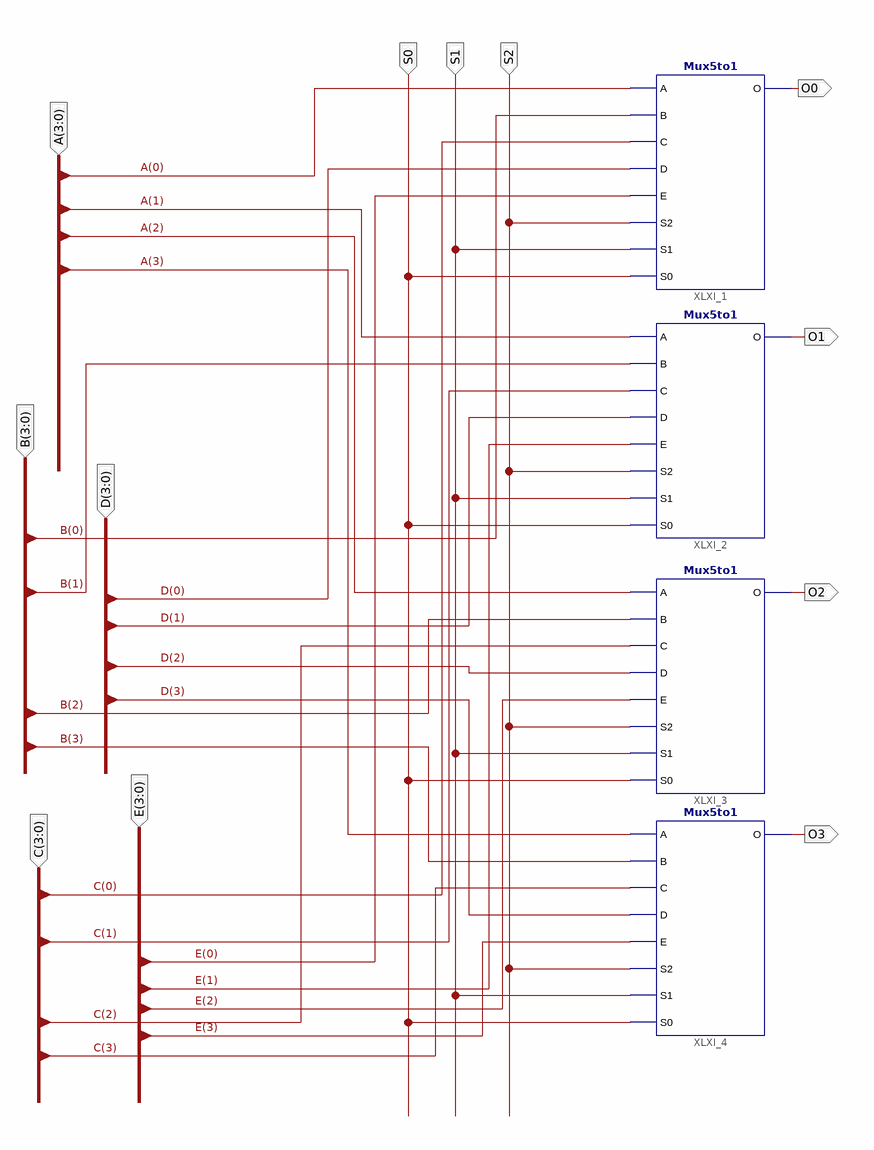
[diagram p0: schematic sheet 1]
// Xilinx ISE schematic Mux5to1_4Bit.sch (spartan3e) as structural Verilog: 4 symbols, 12 ports
module Mux5to1_4Bit (
  input  S2,
  input  S1,
  input  S0,
  input  [3:0] A,
  input  [3:0] D,
  input  [3:0] B,
  input  [3:0] C,
  input  [3:0] E,
  output O1,
  output O2,
  output O3,
  output O0
);

  Mux5to1 XLXI_1 (.A(A[0]), .B(B[0]), .C(C[0]), .D(D[0]), .E(E[0]), .S2(S2), .O(O0), .S0(S0), .S1(S1));
  Mux5to1 XLXI_2 (.A(A[1]), .B(B[1]), .C(C[1]), .D(D[1]), .E(E[1]), .S2(S2), .O(O1), .S0(S0), .S1(S1));
  Mux5to1 XLXI_3 (.A(A[2]), .B(B[2]), .C(C[2]), .D(D[2]), .E(E[2]), .S2(S2), .O(O2), .S0(S0), .S1(S1));
  Mux5to1 XLXI_4 (.A(A[3]), .B(B[3]), .C(C[3]), .D(D[3]), .E(E[3]), .S2(S2), .O(O3), .S0(S0), .S1(S1));
endmodule
